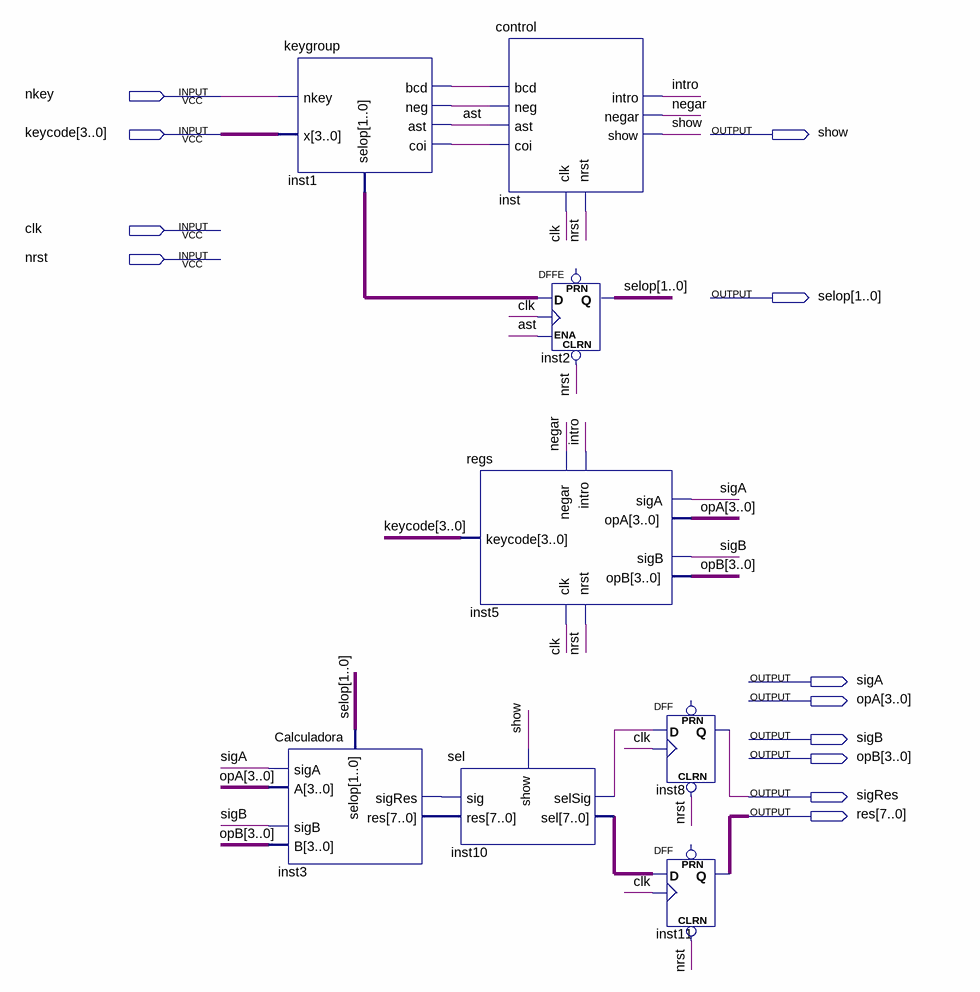
[diagram p0: schematic sheet]
// Quartus schematic ppal.bdf as structural Verilog: 8 symbols, 12 pins
module ppal (
  input  nkey,
  input  [3:0] keycode,
  input  clk,
  input  nrst,
  output show,
  output [1:0] selop,
  output sigA,
  output [3:0] opA,
  output sigB,
  output [3:0] opB,
  output sigRes,
  output [7:0] res
);

  wire ast, inst1_bcd, inst1_coi, inst1_neg, inst3_sigres, inst10_selsig, intro, negar;
  wire [1:0] inst1_selop;
  wire [7:0] inst3_res, inst10_sel;

  keygroup inst1 (
    .x(keycode), .nkey(nkey), .bcd(inst1_bcd), .neg(inst1_neg), .ast(ast), .coi(inst1_coi),
    .selop(inst1_selop));
  Calculadora inst3 (.selop(selop), .sigA(sigA), .sigB(sigB), .A(opA), .B(opB), .sigRes(inst3_sigres), .res(inst3_res));
  control inst (
    .clk(clk), .nrst(nrst), .bcd(inst1_bcd), .neg(inst1_neg), .ast(ast), .coi(inst1_coi), .intro(intro),
    .negar(negar), .show(show));
  regs inst5 (
    .keycode(keycode), .clk(clk), .nrst(nrst), .intro(intro), .negar(negar), .opA(opA), .opB(opB),
    .sigA(sigA), .sigB(sigB));
  sel inst10 (.sig(inst3_sigres), .res(inst3_res), .show(show), .selSig(inst10_selsig), .sel(inst10_sel));
  DFFE inst2[1:0] (.CLRN(nrst), .D(inst1_selop), .CLK(clk), .ENA(ast), .Q(selop));  // open: PRN
  DFF inst8 (.CLRN(nrst), .CLK(clk), .D(inst10_selsig), .Q(sigRes));  // open: PRN
  DFF inst11[7:0] (.CLRN(nrst), .CLK(clk), .D(inst10_sel), .Q(res));  // open: PRN
endmodule
